# Altium project Angler_Main_PCB_V1.PrjPcb
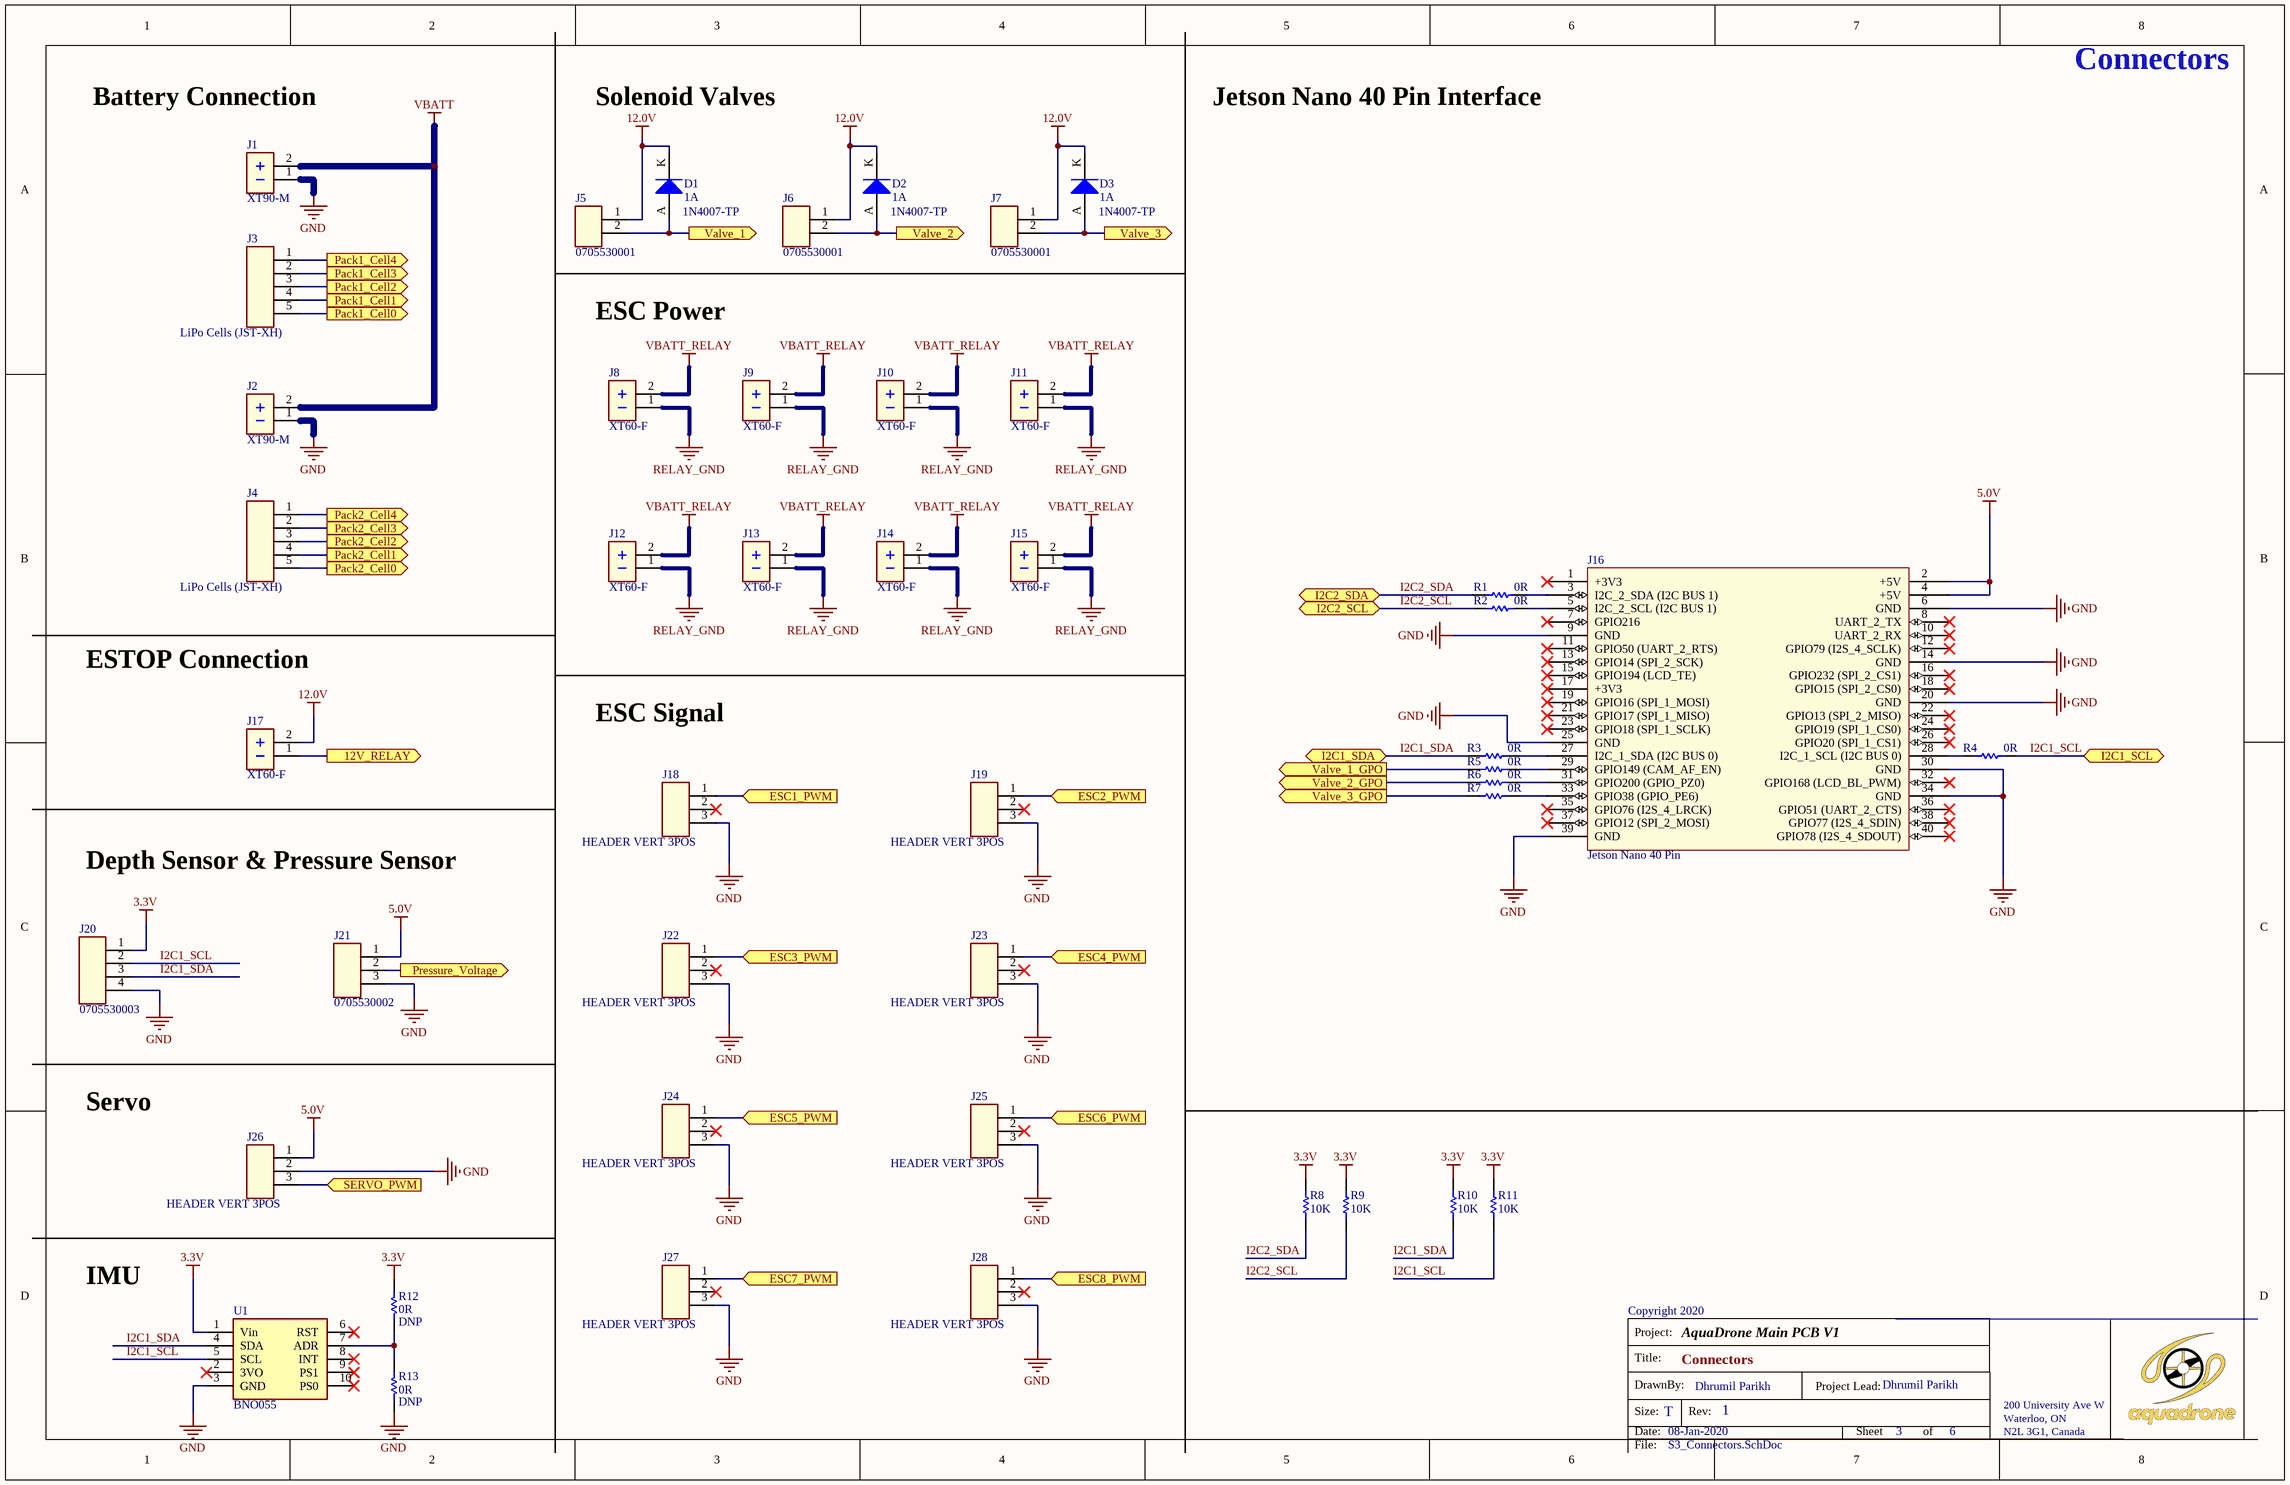
[diagram p0: S3_Connectors.SchDoc]
Copyright: Copyright 2020; DrawnBy: Dhrumil Parikh; PageSize: T; PCBDate: 08-Jan-2020; PCBName: AquaDrone Main PCB V1; PCBPartNumber: AD-PCB-001; PCBRevision: 1.0; ProjectTitle: AquaDrone Main PCB V1; SchDate: 08-Jan-2020; SchDrawnBy: Dhrumil Parikh; SchNumber: AD-SCH-001; SchRevision: 1; SheetTotal: 5
4 sheets, 145 parts. Net scope: flat (ports and power ports of the same name join across sheets).
Board file: AquaDrone_Main_PCB_V1.PcbDoc
Sheets:
  S3_Connectors.SchDoc
  S4_Power_Supply.SchDoc
  S5_Communications.SchDoc
  S6_Solenoid_Valve_Interlock.SchDoc

## Sheet S3_Connectors.SchDoc: Connectors
size Tabloid; DrawnBy: Dhrumil Parikh; SheetNumber: 3; SheetTotal: 6; PageSetup: Record=PageOptions|CenterHorizontal=True|CenterVertical=True|PrintScale=0.62|XCorrection=1.00|YCorrection=1.00|PrintKind=1|BorderSize=5000000|LeftOffset=0|BottomOffset=0|Orientation=2|PaperLength=1000|PaperWidth=1000|Scale=100|PaperSource=7|PrintQuality=600|MediaType=1|DitherType=10|PaperKind=Letter|PrintScaleMode=1; PageSize: T

### Parts
D1  value 1N4007-TP  CURRENT: 1A  [DIOAD1405W90L465D235]  (hidden comment: DIODE GEN PURP 1KV 1A DO41)
D2  value 1N4007-TP  CURRENT: 1A  [DIOAD1405W90L465D235]  (hidden comment: DIODE GEN PURP 1KV 1A DO41)
D3  value 1N4007-TP  CURRENT: 1A  [DIOAD1405W90L465D235]  (hidden comment: DIODE GEN PURP 1KV 1A DO41)
J1  value XT90-M  [XT90]  (hidden comment: CONN XT90 MALE)
J2  value XT90-M  [XT90]  (hidden comment: CONN XT90 MALE)
J3  value LiPo Cells (JST-XH)  [SHDR5W64P0X250_1X5_1490X1150X610P]  (hidden comment: CONN HEADER R/A 5POS 2.5MM)
J4  value LiPo Cells (JST-XH)  [SHDR5W64P0X250_1X5_1490X1150X610P]  (hidden comment: CONN HEADER R/A 5POS 2.5MM)
J5  value 0705530001  [SHDRRA2W109P0_254_1X2_762X1359X699P]  (hidden comment: CONN HEADER R/A 2POS 2.54MM)
J6  value 0705530001  [SHDRRA2W109P0_254_1X2_762X1359X699P]  (hidden comment: CONN HEADER R/A 2POS 2.54MM)
J7  value 0705530001  [SHDRRA2W109P0_254_1X2_762X1359X699P]  (hidden comment: CONN HEADER R/A 2POS 2.54MM)
J8  value XT60-F  [XT60]  (hidden comment: CONN XT60 FEMALE)
J9  value XT60-F  [XT60]  (hidden comment: CONN XT60 FEMALE)
J10  value XT60-F  [XT60]  (hidden comment: CONN XT60 FEMALE)
J11  value XT60-F  [XT60]  (hidden comment: CONN XT60 FEMALE)
J12  value XT60-F  [XT60]  (hidden comment: CONN XT60 FEMALE)
J13  value XT60-F  [XT60]  (hidden comment: CONN XT60 FEMALE)
J14  value XT60-F  [XT60]  (hidden comment: CONN XT60 FEMALE)
J15  value XT60-F  [XT60]  (hidden comment: CONN XT60 FEMALE)
J16  value Jetson Nano 40 Pin  [Jetson Nano]  (hidden comment: Jetson Nano 40 Pin Interface)
J17  value XT60-F  [XT60]  (hidden comment: CONN XT60 FEMALE)
J18  value HEADER VERT 3POS  [61300311121]  (hidden comment: CONN HEADER VERT 3POS 2.54MM)
J19  value HEADER VERT 3POS  [61300311121]  (hidden comment: CONN HEADER VERT 3POS 2.54MM)
J20  value 0705530003  [SHDR4W97P0X254_1X4_1271X1359X699P]  (hidden comment: CONN HEADER R/A 4POS 2.54MM)
J21  value 0705530002  [SHDR3W89P0X254_1X3_1017X1359X699P]  (hidden comment: CONN HEADER R/A 3POS 2.54MM)
J22  value HEADER VERT 3POS  [61300311121]  (hidden comment: CONN HEADER VERT 3POS 2.54MM)
J23  value HEADER VERT 3POS  [61300311121]  (hidden comment: CONN HEADER VERT 3POS 2.54MM)
J24  value HEADER VERT 3POS  [61300311121]  (hidden comment: CONN HEADER VERT 3POS 2.54MM)
J25  value HEADER VERT 3POS  [61300311121]  (hidden comment: CONN HEADER VERT 3POS 2.54MM)
J26  value HEADER VERT 3POS  [61300311121]  (hidden comment: CONN HEADER VERT 3POS 2.54MM)
J27  value HEADER VERT 3POS  [61300311121]  (hidden comment: CONN HEADER VERT 3POS 2.54MM)
J28  value HEADER VERT 3POS  [61300311121]  (hidden comment: CONN HEADER VERT 3POS 2.54MM)
R1  value 0R  [RESC2012X07N]  (hidden comment: RES SMD 0 OHM JUMPER 1/8W 0805)
R2  value 0R  [RESC2012X07N]  (hidden comment: RES SMD 0 OHM JUMPER 1/8W 0805)
R3  value 0R  [RESC2012X07N]  (hidden comment: RES SMD 0 OHM JUMPER 1/8W 0805)
R4  value 0R  [RESC2012X07N]  (hidden comment: RES SMD 0 OHM JUMPER 1/8W 0805)
R5  value 0R  [RESC2012X07N]  (hidden comment: RES SMD 0 OHM JUMPER 1/8W 0805)
R6  value 0R  [RESC2012X07N]  (hidden comment: RES SMD 0 OHM JUMPER 1/8W 0805)
R7  value 0R  [RESC2012X07N]  (hidden comment: RES SMD 0 OHM JUMPER 1/8W 0805)
R8  value 10K  [RESC1608X06N]  (hidden comment: RES SMD 10K OHM 1% 1/10W 0603)
R9  value 10K  [RESC1608X06N]  (hidden comment: RES SMD 10K OHM 1% 1/10W 0603)
R10  value 10K  [RESC1608X06N]  (hidden comment: RES SMD 10K OHM 1% 1/10W 0603)
R11  value 10K  [RESC1608X06N]  (hidden comment: RES SMD 10K OHM 1% 1/10W 0603)
R12  value 0R  NOSTUFF: DNP  [RESC2012X07N]  (hidden comment: RES SMD 0 OHM JUMPER 1/8W 0805)
R13  value 0R  NOSTUFF: DNP  [RESC2012X07N]  (hidden comment: RES SMD 0 OHM JUMPER 1/8W 0805)
U1  IC BNO055  [BNO055]  (value not drawn)

### Ports
12V_RELAY (out), ESC1_PWM (in), ESC2_PWM (in), ESC3_PWM (in), ESC4_PWM (in), ESC5_PWM (in), ESC6_PWM (in), ESC7_PWM (in), ESC8_PWM (in), I2C1_SCL (bidir), I2C1_SDA (bidir), I2C2_SCL (bidir), I2C2_SDA (bidir), Pack1_Cell0 (out), Pack1_Cell1 (out), Pack1_Cell2 (out), Pack1_Cell3 (out), Pack1_Cell4 (out), Pack2_Cell0 (out), Pack2_Cell1 (out), Pack2_Cell2 (out), Pack2_Cell3 (out), Pack2_Cell4 (out), Pressure_Voltage (out), SERVO_PWM (in), Valve_1 (out), Valve_1_GPO (out), Valve_2 (out), Valve_2_GPO (out), Valve_3 (out), Valve_3_GPO (out)

### Nets
3.3V: J20.1 R8.2 R9.2 R10.2 R11.2 R12.1 U1.1(Vin)
5.0V: J16.2(+5V) J16.4(+5V) J21.1 J26.1
12.0V: D1.K D2.K D3.K J5.1 J6.1 J7.1 J17.2
GND: J1.1 J2.1 J16.6(GND) J16.9(GND) J16.14(GND) J16.20(GND) J16.25(GND) J16.30(GND) J16.34(GND) J16.39(GND) J18.3 J19.3 J20.4 J21.3 J22.3 J23.3 J24.3 J25.3 J26.2 J27.3 J28.3 R13.2 U1.3(GND)
RELAY_GND: J8.1 J9.1 J10.1 J11.1 J12.1 J13.1 J14.1 J15.1
VBATT: J1.2 J2.2
VBATT_RELAY: J8.2 J9.2 J10.2 J11.2 J12.2 J13.2 J14.2 J15.2
12V_RELAY: J17.1 ; port 12V_RELAY
ESC1_PWM: J18.1 ; port ESC1_PWM
ESC2_PWM: J19.1 ; port ESC2_PWM
ESC3_PWM: J22.1 ; port ESC3_PWM
ESC4_PWM: J23.1 ; port ESC4_PWM
ESC5_PWM: J24.1 ; port ESC5_PWM
ESC6_PWM: J25.1 ; port ESC6_PWM
ESC7_PWM: J27.1 ; port ESC7_PWM
ESC8_PWM: J28.1 ; port ESC8_PWM
I2C1_SCL: J20.2 R4.2 R11.1 U1.5(SCL) ; port I2C1_SCL
I2C1_SDA: J20.3 R3.1 R10.1 U1.4(SDA) ; port I2C1_SDA
I2C2_SCL: R2.1 R9.1 ; port I2C2_SCL
I2C2_SDA: R1.1 R8.1 ; port I2C2_SDA
Pack1_Cell0: J3.5 ; port Pack1_Cell0
Pack1_Cell1: J3.4 ; port Pack1_Cell1
Pack1_Cell2: J3.3 ; port Pack1_Cell2
Pack1_Cell3: J3.2 ; port Pack1_Cell3
Pack1_Cell4: J3.1 ; port Pack1_Cell4
Pack2_Cell0: J4.5 ; port Pack2_Cell0
Pack2_Cell1: J4.4 ; port Pack2_Cell1
Pack2_Cell2: J4.3 ; port Pack2_Cell2
Pack2_Cell3: J4.2 ; port Pack2_Cell3
Pack2_Cell4: J4.1 ; port Pack2_Cell4
Pressure_Voltage: J21.2 ; port Pressure_Voltage
SERVO_PWM: J26.3 ; port SERVO_PWM
Valve_1: D1.A J5.2 ; port Valve_1
Valve_1_GPO: R5.1 ; port Valve_1_GPO
Valve_2: D2.A J6.2 ; port Valve_2
Valve_2_GPO: R6.1 ; port Valve_2_GPO
Valve_3: D3.A J7.2 ; port Valve_3
Valve_3_GPO: R7.1 ; port Valve_3_GPO
NetJ16_3: J16.3(I2C_2_SDA_(I2C_BUS_1)) R1.2
NetJ16_5: J16.5(I2C_2_SCL_(I2C_BUS_1)) R2.2
NetJ16_27: J16.27(I2C_1_SDA_(I2C_BUS_0)) R3.2
NetJ16_28: J16.28(I2C_1_SCL_(I2C_BUS_0)) R4.1
NetJ16_29: J16.29(GPIO149_(CAM_AF_EN)) R5.2
NetJ16_31: J16.31(GPIO200_(GPIO_PZ0)) R6.2
NetJ16_33: J16.33(GPIO38_(GPIO_PE6)) R7.2
NetR12_2: R12.2 R13.1 U1.7(ADR)

Not connected (* = marked no-connect by the designer): J16 1(+3V3)* 7(GPIO216)* 8(UART_2_TX)* 10(UART_2_RX)* 11(GPIO50_(UART_2_RTS))* 12(GPIO79_(I2S_4_SCLK))* 13(GPIO14_(SPI_2_SCK))* 15(GPIO194_(LCD_TE))* 16(GPIO232_(SPI_2_CS1))* 17(+3V3)* 18(GPIO15_(SPI_2_CS0))* 19(GPIO16_(SPI_1_MOSI))* 21(GPIO17_(SPI_1_MISO))* 22(GPIO13_(SPI_2_MISO))* 23(GPIO18_(SPI_1_SCLK))* 24(GPIO19_(SPI_1_CS0))* 26(GPIO20_(SPI_1_CS1))* 32(GPIO168_(LCD_BL_PWM))* 35(GPIO76_(I2S_4_LRCK))* 36(GPIO51_(UART_2_CTS))* 37(GPIO12_(SPI_2_MOSI))* 38(GPIO77_(I2S_4_SDIN))* 40(GPIO78_(I2S_4_SDOUT))*; J18 2*; J19 2*; J22 2*; J23 2*; J24 2*; J25 2*; J27 2*; J28 2*; U1 2(3VO)* 6(RST)* 8(INT)* 9(PS1)* 10(PS0)*

### Notes on the sheet
- Battery Connection
- Solenoid Valves
- Jetson Nano 40 Pin Interface
- ESC Power
- ESTOP Connection
- ESC Signal
- Depth Sensor & Pressure Sensor
- Servo
- IMU
- Title:
- Project:
- Size:
- Date:
- DrawnBy:
- Rev:
- Project Lead:
- Sheet
- Dhrumil Parikh
- of
- 200 University Ave W
- Waterloo, ON
- N2L 3G1, Canada
- File:

### Library data of the parts
D1-D3 = DIODE GEN PURP 1KV 1A DO41: MFG: Micro Commercial Co; VR: 1000V; COST: 0.14; MFG_PART_NO: 1N4007-TP
J1 J2 = CONN XT90 MALE: MFG_PART_NO: FIT0588; MFG: DFRobot; COST: 5.66000
J3 J4 = CONN HEADER R/A 5POS 2.5MM: MFG_PART_NO: S5B-XH-A(LF)(SN); MFG: JST Sales America Inc.; COST: 0.43
J5-J7 = CONN HEADER R/A 2POS 2.54MM: MFG: Molex; COST: 1.12; MFG_PART_NO: 0705530001
J8-J15 J17 = CONN XT60 FEMALE: MFG_PART_NO: FIT0587; MFG: DFRobot; COST: 2.18
J18 J19 J22-J28 = CONN HEADER VERT 3POS 2.54MM: MFG: Wurth Electronics Inc.; COST: 0.18; MFG_PART_NO: 61300311121
J20 = CONN HEADER R/A 4POS 2.54MM: MFG: Molex; COST: 1.51; MFG_PART_NO: 0705530003
J21 = CONN HEADER R/A 3POS 2.54MM: MFG: Molex; COST: 1.47; MFG_PART_NO: 0705530002
R1-R7 R12 R13 = RES SMD 0 OHM JUMPER 1/8W 0805: MFG_PART_NO: ERJ-6GEY0R00V; MFG: Panasonic; COST: 0.15
R8-R11 = RES SMD 10K OHM 1% 1/10W 0603: MFG_PART_NO: CRCW060310K0FKEA; MFG: Vishay Dale; COST: 0.15; TOLERANCE: 1%
U1 = IC BNO055: MFG: Adafruit Industries LLC; COST: 50; VALUE: BNO055; MFG_PART_NO: BNO055
J16 = Jetson Nano 40 Pin Interface: COST: 60; MFG: Jetson; MFG_PART_NO: Nano

## Sheet S4_Power_Supply.SchDoc: Power Supply
size Tabloid; DrawnBy: Dhrumil Parikh; SheetNumber: 4; SheetTotal: 6; PageSetup: Record=PageOptions|CenterHorizontal=True|CenterVertical=True|PrintScale=0.62|XCorrection=1.00|YCorrection=1.00|PrintKind=1|BorderSize=5000000|LeftOffset=0|BottomOffset=0|Orientation=2|PaperLength=1000|PaperWidth=1000|Scale=100|PaperSource=7|PrintQuality=600|MediaType=1|DitherType=10|PaperKind=Letter|PrintScaleMode=1; PageSize: T
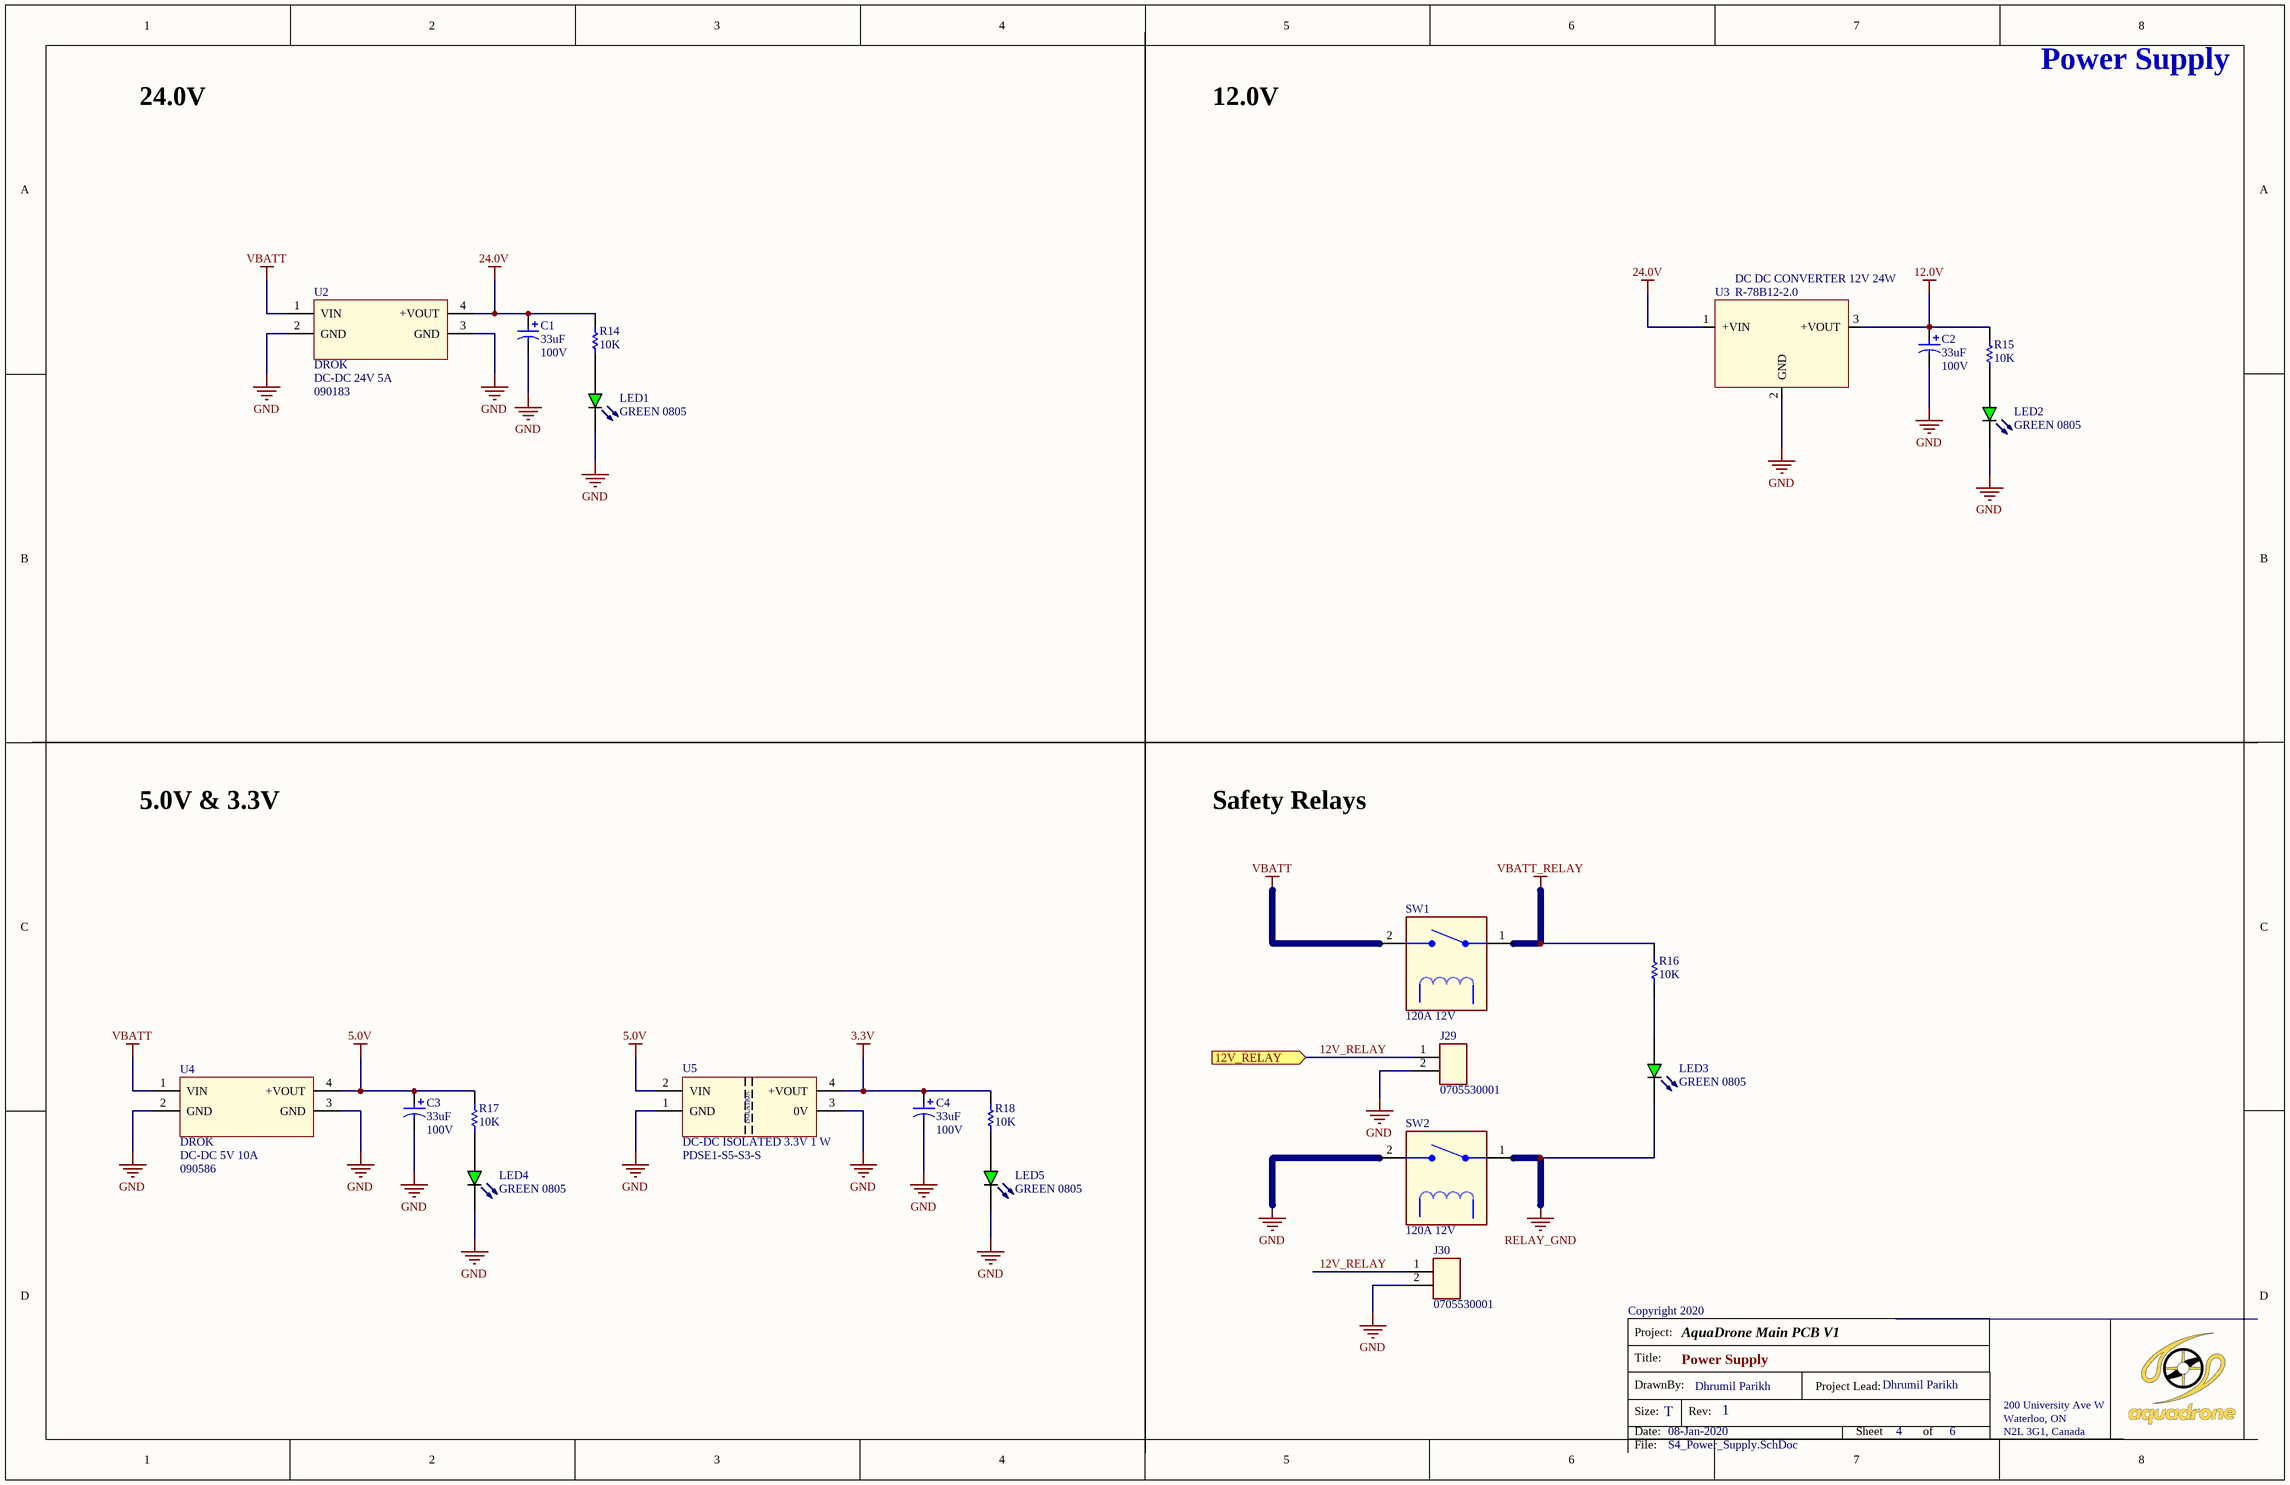
[diagram p1: S4_Power_Supply.SchDoc]

### Parts
C1  value 33uF  VOLTAGE: 100V  [CAPPRD350W60D825H1700]  (hidden comment: CAP ALUM 33UF 20% 100V RADIAL)
C2  value 33uF  VOLTAGE: 100V  [CAPPRD350W60D825H1700]  (hidden comment: CAP ALUM 33UF 20% 100V RADIAL)
C3  value 33uF  VOLTAGE: 100V  [CAPPRD350W60D825H1700]  (hidden comment: CAP ALUM 33UF 20% 100V RADIAL)
C4  value 33uF  VOLTAGE: 100V  [CAPPRD350W60D825H1700]  (hidden comment: CAP ALUM 33UF 20% 100V RADIAL)
J29  value 0705530001  [SHDRRA2W109P0_254_1X2_762X1359X699P]  (hidden comment: CONN HEADER R/A 2POS 2.54MM)
J30  value 0705530001  [SHDRRA2W109P0_254_1X2_762X1359X699P]  (hidden comment: CONN HEADER R/A 2POS 2.54MM)
LED1  value GREEN 0805  [LED0805]  (hidden comment: LED GREEN CLEAR 0805 SMD)
LED2  value GREEN 0805  [LED0805]  (hidden comment: LED GREEN CLEAR 0805 SMD)
LED3  value GREEN 0805  [LED0805]  (hidden comment: LED GREEN CLEAR 0805 SMD)
LED4  value GREEN 0805  [LED0805]  (hidden comment: LED GREEN CLEAR 0805 SMD)
LED5  value GREEN 0805  [LED0805]  (hidden comment: LED GREEN CLEAR 0805 SMD)
R14  value 10K  [RESC1608X06N]  (hidden comment: RES SMD 10K OHM 1% 1/10W 0603)
R15  value 10K  [RESC1608X06N]  (hidden comment: RES SMD 10K OHM 1% 1/10W 0603)
R16  value 10K  [RESC1608X06N]  (hidden comment: RES SMD 10K OHM 1% 1/10W 0603)
R17  value 10K  [RESC1608X06N]  (hidden comment: RES SMD 10K OHM 1% 1/10W 0603)
R18  value 10K  [RESC1608X06N]  (hidden comment: RES SMD 10K OHM 1% 1/10W 0603)
SW1  value 120A 12V  [G9TB-U1ATW-E DC12]  (hidden comment: RELAY GEN PURPOSE SPST 120A 12V)
SW2  value 120A 12V  [G9TB-U1ATW-E DC12]  (hidden comment: RELAY GEN PURPOSE SPST 120A 12V)
U2  MFG: DROK  MFG_PART_NO: 090183  [DROK 090183 24V 5A]  (hidden comment: DC-DC 24V 5A)
U3  DC DC CONVERTER 12V 24W  [R-78B12-2.0]
U4  MFG: DROK  MFG_PART_NO: 090586  [DROK 090586 5V 10A]  (hidden comment: DC-DC 5V 10A)
U5  MFG_PART_NO: PDSE1-S5-S3-S  [PDSE1S5S3S]  (hidden comment: DC-DC ISOLATED 3.3V 1 W)

### Ports
12V_RELAY (in)

### Nets
3.3V: C4.1 R18.2 U5.4(+VOUT)
5.0V: C3.1 R17.2 U4.4(+VOUT) U5.2(VIN)
12.0V: C2.1 R15.2 U3.3(+VOUT)
24.0V: C1.1 R14.2 U2.4(+VOUT) U3.1(+VIN)
GND: C1.2 C2.2 C3.2 C4.2 J29.2 J30.2 LED1.K LED2.K LED4.K LED5.K SW2.2 U2.2(GND) U2.3(GND) U3.2(GND) U4.2(GND) U4.3(GND) U5.1(GND) U5.3(0V)
RELAY_GND: LED3.K SW2.1
VBATT: SW1.2 U2.1(VIN) U4.1(VIN)
VBATT_RELAY: R16.2 SW1.1
12V_RELAY: J29.1 J30.1 ; port 12V_RELAY
NetLED1_A: LED1.A R14.1
NetLED2_A: LED2.A R15.1
NetLED3_A: LED3.A R16.1
NetLED4_A: LED4.A R17.1
NetLED5_A: LED5.A R18.1

### Notes on the sheet
- 24.0V
- 12.0V
- 5.0V & 3.3V
- Safety Relays
- Title:
- Project:
- Size:
- Date:
- DrawnBy:
- Rev:
- Project Lead:
- Sheet
- Dhrumil Parikh
- of
- 200 University Ave W
- Waterloo, ON
- N2L 3G1, Canada
- File:
- (in symbol DC-DC ISOLATED 3.3V 1 W) ISOLATION

### Library data of the parts
C1-C4 = CAP ALUM 33UF 20% 100V RADIAL: MFG_PART_NO: UPM2A330MPD1TD; MFG: Nichicon; COST: 0.18; TOLERANCE: 20%; DIELECTRIC: ALUM
J29 J30 = CONN HEADER R/A 2POS 2.54MM: MFG: Molex; COST: 1.12; MFG_PART_NO: 0705530001
LED1-LED5 = LED GREEN CLEAR 0805 SMD: MFG_PART_NO: 150080VS75000; MFG: Würth Elektronik; COST: 0.26
R14-R18 = RES SMD 10K OHM 1% 1/10W 0603: as R8 on sheet S3_Connectors; COST: 0.15; TOLERANCE: 1%
SW1 SW2 = RELAY GEN PURPOSE SPST 120A 12V: MFG: Omron; COST: 23.27; MFG_PART_NO: G9TB-U1ATW-E DC12
U3 = DC DC CONVERTER 12V 24W: MFG: Recom Power; COST: 14.18; VALUE: DC DC CONVERTER 12V 24W; MFG_PART_NO: R-78B12-2.0
U5 = DC-DC ISOLATED 3.3V 1 W: MFG: CUI Inc.; COST: 3.07; VALUE: DC-DC ISOLATED 3.3V 1 W
U2 = DC-DC 24V 5A: COST: 30; VALUE: DC-DC 24V 5A
U4 = DC-DC 5V 10A: COST: 15; VALUE: DC-DC 5V 10A

## Sheet S5_Communications.SchDoc: Communications
size Tabloid; DrawnBy: Dhrumil Parikh; SheetNumber: 5; SheetTotal: 6; PageSetup: Record=PageOptions|CenterHorizontal=True|CenterVertical=True|PrintScale=0.62|XCorrection=1.00|YCorrection=1.00|PrintKind=1|BorderSize=5000000|LeftOffset=0|BottomOffset=0|Orientation=2|PaperLength=1000|PaperWidth=1000|Scale=100|PaperSource=7|PrintQuality=600|MediaType=1|DitherType=10|PaperKind=Letter|PrintScaleMode=1; PageSize: T
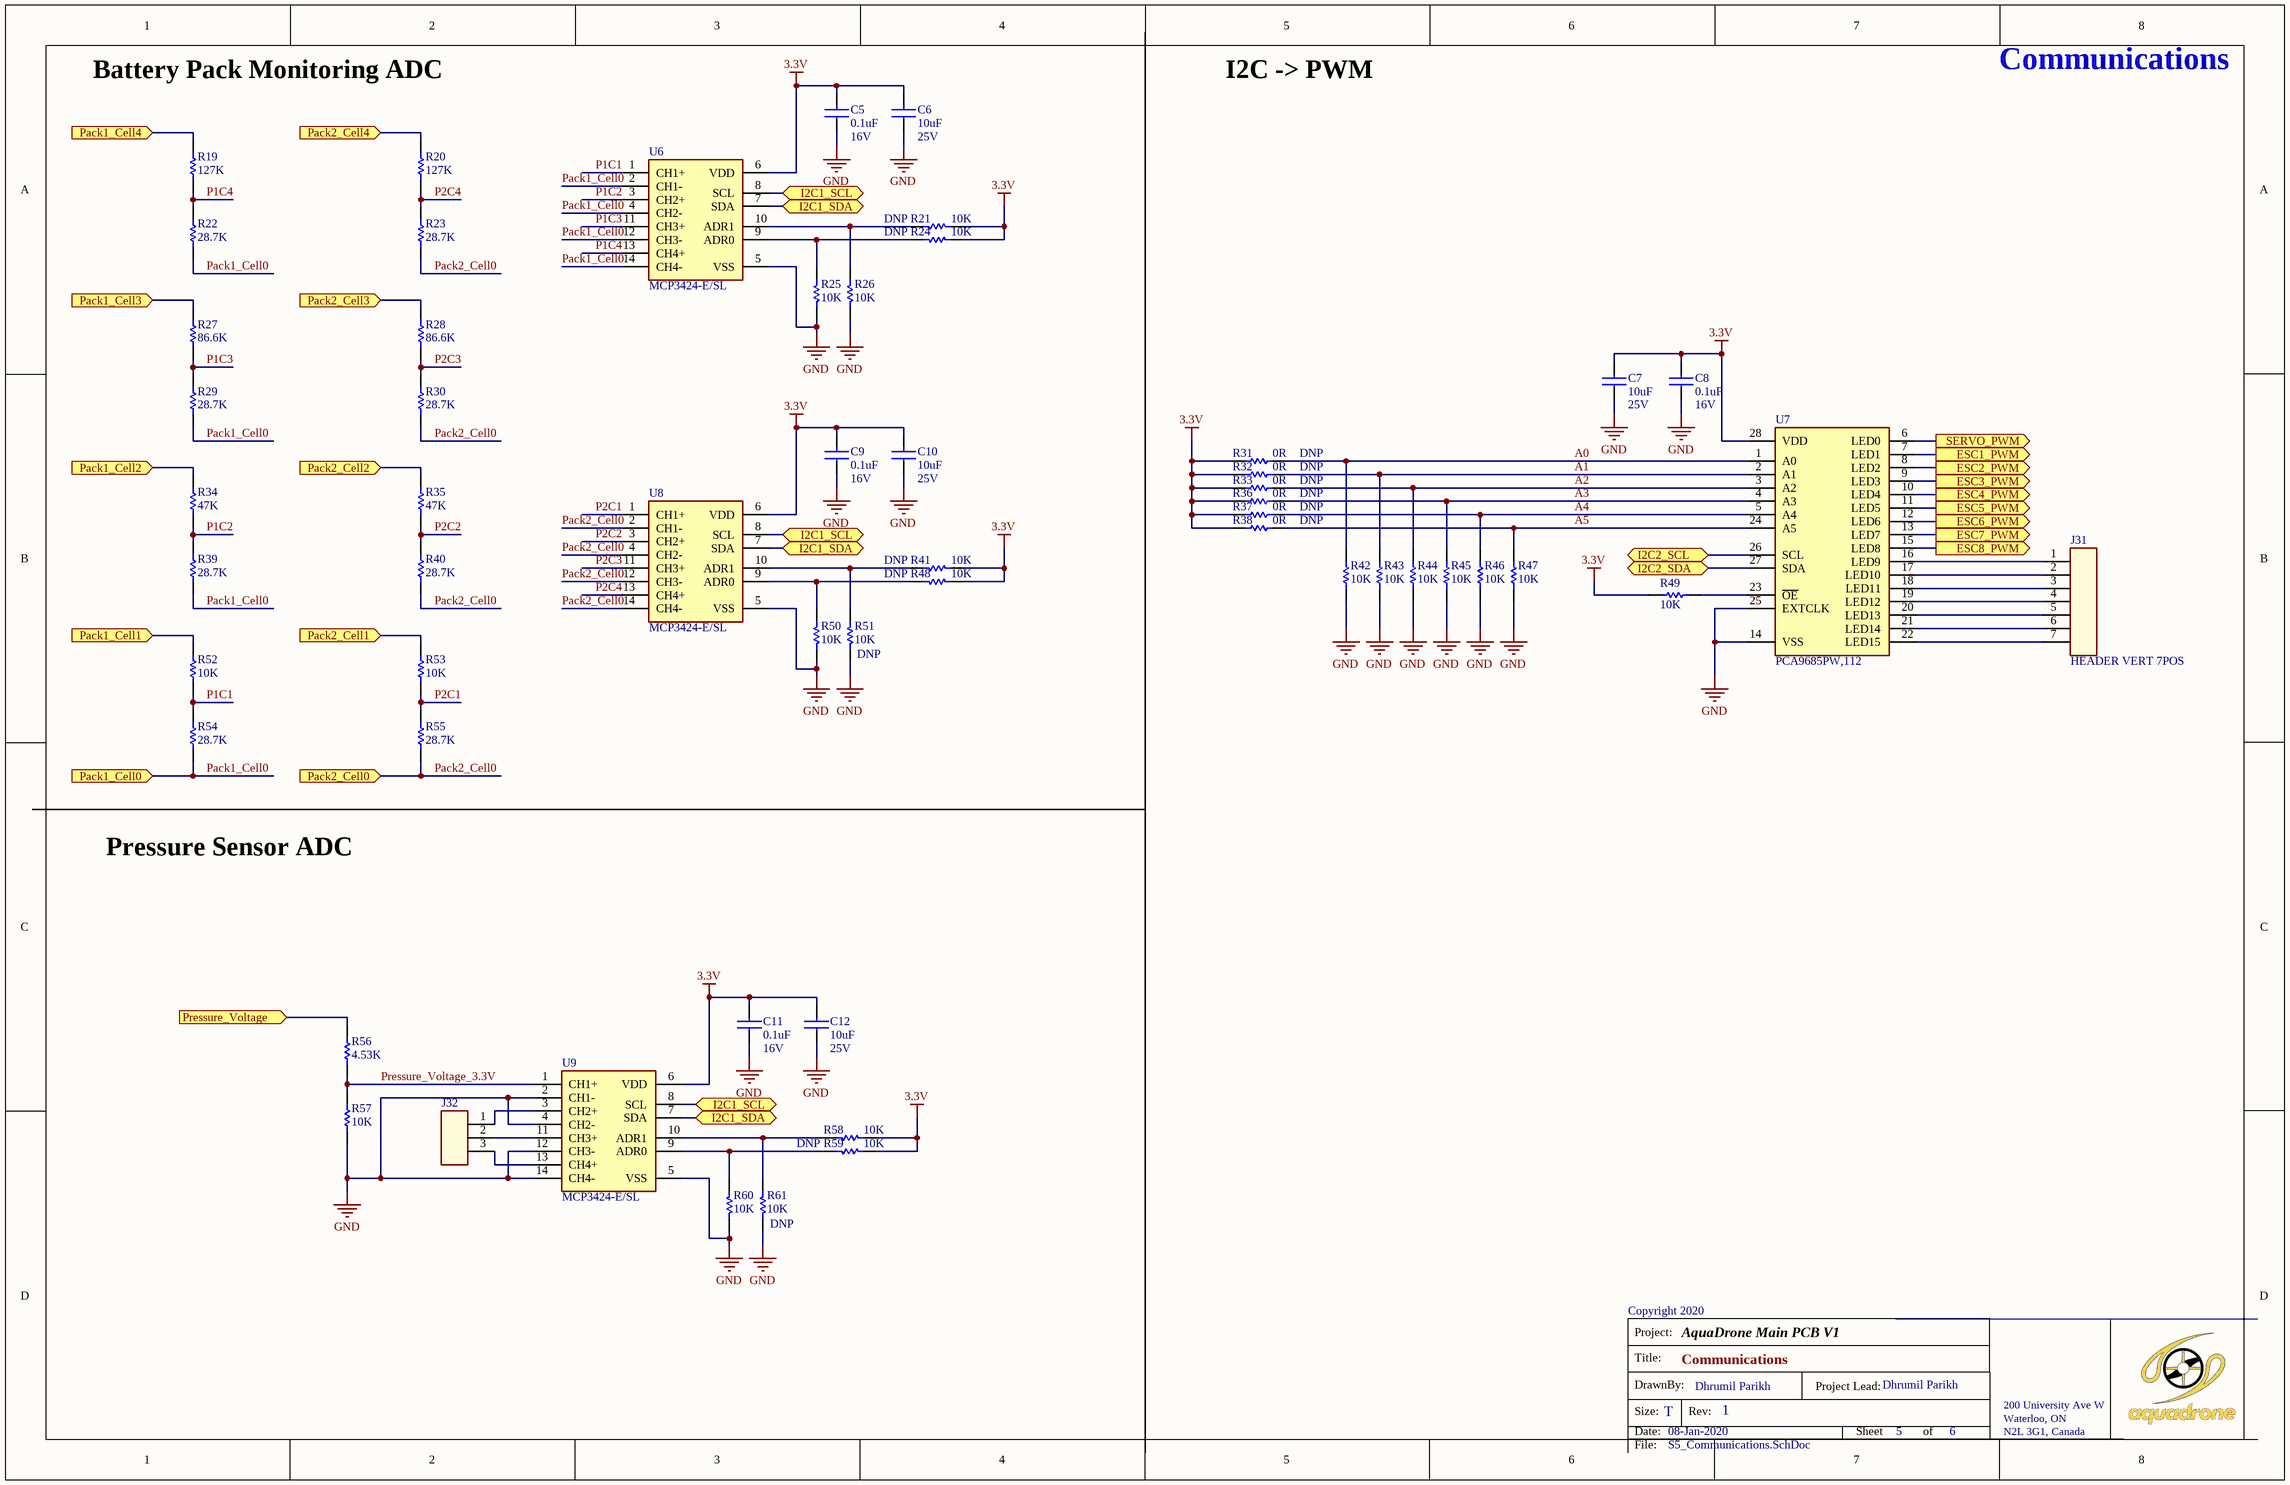
[diagram p2: S5_Communications.SchDoc]

### Parts
C5  value 0.1uF  VOLTAGE: 16V  [CAPC1608X09N]  (hidden comment: CAP CER 0.1UF 16V X7R 0603)
C6  value 10uF  VOLTAGE: 25V  [CAPC1608X09N]  (hidden comment: CAP CER 10UF 25V X5R 0603)
C7  value 10uF  VOLTAGE: 25V  [CAPC1608X09N]  (hidden comment: CAP CER 10UF 25V X5R 0603)
C8  value 0.1uF  VOLTAGE: 16V  [CAPC1608X09N]  (hidden comment: CAP CER 0.1UF 16V X7R 0603)
C9  value 0.1uF  VOLTAGE: 16V  [CAPC1608X09N]  (hidden comment: CAP CER 0.1UF 16V X7R 0603)
C10  value 10uF  VOLTAGE: 25V  [CAPC1608X09N]  (hidden comment: CAP CER 10UF 25V X5R 0603)
C11  value 0.1uF  VOLTAGE: 16V  [CAPC1608X09N]  (hidden comment: CAP CER 0.1UF 16V X7R 0603)
C12  value 10uF  VOLTAGE: 25V  [CAPC1608X09N]  (hidden comment: CAP CER 10UF 25V X5R 0603)
J31  value HEADER VERT 7POS  [61300711121]  (hidden comment: CONN HEADER VERT 7POS 2.54MM)
J32  CONN HEADER VERT 3POS 2.54MM  [61300311121]  (value not drawn)
R19  value 127K  [RESC1608X06N]  (hidden comment: RES SMD 127K OHM 1% 1/10W 0603)
R20  value 127K  [RESC1608X06N]  (hidden comment: RES SMD 127K OHM 1% 1/10W 0603)
R21  value 10K  NOSTUFF: DNP  [RESC1608X06N]  (hidden comment: RES SMD 10K OHM 1% 1/10W 0603)
R22  value 28.7K  [RESC1608X06N]  (hidden comment: RES SMD 28.7K OHM 1% 1/10W 0603)
R23  value 28.7K  [RESC1608X06N]  (hidden comment: RES SMD 28.7K OHM 1% 1/10W 0603)
R24  value 10K  NOSTUFF: DNP  [RESC1608X06N]  (hidden comment: RES SMD 10K OHM 1% 1/10W 0603)
R25  value 10K  [RESC1608X06N]  (hidden comment: RES SMD 10K OHM 1% 1/10W 0603)
R26  value 10K  [RESC1608X06N]  (hidden comment: RES SMD 10K OHM 1% 1/10W 0603)
R27  value 86.6K  [RESC1608X06N]  (hidden comment: RES SMD 86.6K OHM 1% 1/10W 0603)
R28  value 86.6K  [RESC1608X06N]  (hidden comment: RES SMD 86.6K OHM 1% 1/10W 0603)
R29  value 28.7K  [RESC1608X06N]  (hidden comment: RES SMD 28.7K OHM 1% 1/10W 0603)
R30  value 28.7K  [RESC1608X06N]  (hidden comment: RES SMD 28.7K OHM 1% 1/10W 0603)
R31  value 0R  NOSTUFF: DNP  [RESC2012X07N]  (hidden comment: RES SMD 0 OHM JUMPER 1/8W 0805)
R32  value 0R  NOSTUFF: DNP  [RESC2012X07N]  (hidden comment: RES SMD 0 OHM JUMPER 1/8W 0805)
R33  value 0R  NOSTUFF: DNP  [RESC2012X07N]  (hidden comment: RES SMD 0 OHM JUMPER 1/8W 0805)
R34  value 47K  [RESC1608X06N]  (hidden comment: RES SMD 47K OHM 1% 1/10W 0603)
R35  value 47K  [RESC1608X06N]  (hidden comment: RES SMD 47K OHM 1% 1/10W 0603)
R36  value 0R  NOSTUFF: DNP  [RESC2012X07N]  (hidden comment: RES SMD 0 OHM JUMPER 1/8W 0805)
R37  value 0R  NOSTUFF: DNP  [RESC2012X07N]  (hidden comment: RES SMD 0 OHM JUMPER 1/8W 0805)
R38  value 0R  NOSTUFF: DNP  [RESC2012X07N]  (hidden comment: RES SMD 0 OHM JUMPER 1/8W 0805)
R39  value 28.7K  [RESC1608X06N]  (hidden comment: RES SMD 28.7K OHM 1% 1/10W 0603)
R40  value 28.7K  [RESC1608X06N]  (hidden comment: RES SMD 28.7K OHM 1% 1/10W 0603)
R41  value 10K  NOSTUFF: DNP  [RESC1608X06N]  (hidden comment: RES SMD 10K OHM 1% 1/10W 0603)
R42  value 10K  [RESC1608X06N]  (hidden comment: RES SMD 10K OHM 1% 1/10W 0603)
R43  value 10K  [RESC1608X06N]  (hidden comment: RES SMD 10K OHM 1% 1/10W 0603)
R44  value 10K  [RESC1608X06N]  (hidden comment: RES SMD 10K OHM 1% 1/10W 0603)
R45  value 10K  [RESC1608X06N]  (hidden comment: RES SMD 10K OHM 1% 1/10W 0603)
R46  value 10K  [RESC1608X06N]  (hidden comment: RES SMD 10K OHM 1% 1/10W 0603)
R47  value 10K  [RESC1608X06N]  (hidden comment: RES SMD 10K OHM 1% 1/10W 0603)
R48  value 10K  NOSTUFF: DNP  [RESC1608X06N]  (hidden comment: RES SMD 10K OHM 1% 1/10W 0603)
R49  value 10K  [RESC1608X06N]  (hidden comment: RES SMD 10K OHM 1% 1/10W 0603)
R50  value 10K  [RESC1608X06N]  (hidden comment: RES SMD 10K OHM 1% 1/10W 0603)
R51  value 10K  NOSTUFF: DNP  [RESC1608X06N]  (hidden comment: RES SMD 10K OHM 1% 1/10W 0603)
R52  value 10K  [RESC1608X06N]  (hidden comment: RES SMD 10K OHM 1% 1/10W 0603)
R53  value 10K  [RESC1608X06N]  (hidden comment: RES SMD 10K OHM 1% 1/10W 0603)
R54  value 28.7K  [RESC1608X06N]  (hidden comment: RES SMD 28.7K OHM 1% 1/10W 0603)
R55  value 28.7K  [RESC1608X06N]  (hidden comment: RES SMD 28.7K OHM 1% 1/10W 0603)
R56  value 4.53K  [RESC1608X06N]  (hidden comment: RES SMD 4.53K OHM 1% 1/10W 0603)
R57  value 10K  [RESC1608X06N]  (hidden comment: RES SMD 10K OHM 1% 1/10W 0603)
R58  value 10K  [RESC1608X06N]  (hidden comment: RES SMD 10K OHM 1% 1/10W 0603)
R59  value 10K  NOSTUFF: DNP  [RESC1608X06N]  (hidden comment: RES SMD 10K OHM 1% 1/10W 0603)
R60  value 10K  [RESC1608X06N]  (hidden comment: RES SMD 10K OHM 1% 1/10W 0603)
R61  value 10K  NOSTUFF: DNP  [RESC1608X06N]  (hidden comment: RES SMD 10K OHM 1% 1/10W 0603)
U6  MFG_PART_NO: MCP3424-E/SL  [SOIC127P600X175-14N]  (hidden comment: IC ADC 18BIT SIGMA-DELTA 14SOIC)
U7  MFG_PART_NO: PCA9685PW,112  [SOP65P640X110-28N]  (hidden comment: IC LED DRVR LIN DIM 25MA 28TSSOP)
U8  MFG_PART_NO: MCP3424-E/SL  [SOIC127P600X175-14N]  (hidden comment: IC ADC 18BIT SIGMA-DELTA 14SOIC)
U9  MFG_PART_NO: MCP3424-E/SL  [SOIC127P600X175-14N]  (hidden comment: IC ADC 18BIT SIGMA-DELTA 14SOIC)

### Ports
ESC1_PWM (out), ESC2_PWM (out), ESC3_PWM (out), ESC4_PWM (out), ESC5_PWM (out), ESC6_PWM (out), ESC7_PWM (out), ESC8_PWM (out), I2C1_SCL (bidir), I2C1_SDA (bidir), I2C2_SCL (bidir), I2C2_SDA (bidir), Pack1_Cell0 (in), Pack1_Cell1 (in), Pack1_Cell2 (in), Pack1_Cell3 (in), Pack1_Cell4 (in), Pack2_Cell0 (in), Pack2_Cell1 (in), Pack2_Cell2 (in), Pack2_Cell3 (in), Pack2_Cell4 (in), Pressure_Voltage (in), SERVO_PWM (out)

### Nets
3.3V: C5.2 C6.2 C7.2 C8.2 C9.2 C10.2 C11.2 C12.2 R21.1 R24.1 R31.1 R32.1 R33.1 R36.1 R37.1 R38.1 R41.1 R48.1 R49.1 R58.1 R59.1 U6.6(VDD) U7.28(VDD) U8.6(VDD) U9.6(VDD)
GND: C5.1 C6.1 C7.1 C8.1 C9.1 C10.1 C11.1 C12.1 R25.1 R26.1 R42.1 R43.1 R44.1 R45.1 R46.1 R47.1 R50.1 R51.1 R57.1 R60.1 R61.1 U6.5(VSS) U7.14(VSS) U7.25(EXTCLK) U8.5(VSS) U9.2(CH1-) U9.4(CH2-) U9.5(VSS) U9.12(CH3-) U9.14(CH4-)
A0: R31.2 R42.2 U7.1(A0)  [project net A0_5]
A1: R32.2 R43.2 U7.2(A1)  [project net A1_5]
A2: R33.2 R44.2 U7.3(A2)  [project net A2_5]
A3: R36.2 R45.2 U7.4(A3)  [project net A3_5]
A4: R37.2 R46.2 U7.5(A4)  [project net A4_5]
A5: R38.2 R47.2 U7.24(A5)  [project net A5_5]
ESC1_PWM: U7.7(LED1) ; port ESC1_PWM
ESC2_PWM: U7.8(LED2) ; port ESC2_PWM
ESC3_PWM: U7.9(LED3) ; port ESC3_PWM
ESC4_PWM: U7.10(LED4) ; port ESC4_PWM
ESC5_PWM: U7.11(LED5) ; port ESC5_PWM
ESC6_PWM: U7.12(LED6) ; port ESC6_PWM
ESC7_PWM: U7.13(LED7) ; port ESC7_PWM
ESC8_PWM: U7.15(LED8) ; port ESC8_PWM
I2C1_SCL: U6.8(SCL) U8.8(SCL) U9.8(SCL) ; port I2C1_SCL
I2C1_SDA: U6.7(SDA) U8.7(SDA) U9.7(SDA) ; port I2C1_SDA
I2C2_SCL: U7.26(SCL) ; port I2C2_SCL
I2C2_SDA: U7.27(SDA) ; port I2C2_SDA
P1C1: R52.1 R54.2 U6.1(CH1+)  [project net P1C1_5]
P1C2: R34.1 R39.2 U6.3(CH2+)  [project net P1C2_5]
P1C3: R27.1 R29.2 U6.11(CH3+)  [project net P1C3_5]
P1C4: R19.1 R22.2 U6.13(CH4+)  [project net P1C4_5]
P2C1: R53.1 R55.2 U8.1(CH1+)  [project net P2C1_5]
P2C2: R35.1 R40.2 U8.3(CH2+)  [project net P2C2_5]
P2C3: R28.1 R30.2 U8.11(CH3+)  [project net P2C3_5]
P2C4: R20.1 R23.2 U8.13(CH4+)  [project net P2C4_5]
Pack1_Cell0: R22.1 R29.1 R39.1 R54.1 U6.2(CH1-) U6.4(CH2-) U6.12(CH3-) U6.14(CH4-) ; port Pack1_Cell0
Pack1_Cell1: R52.2 ; port Pack1_Cell1
Pack1_Cell2: R34.2 ; port Pack1_Cell2
Pack1_Cell3: R27.2 ; port Pack1_Cell3
Pack1_Cell4: R19.2 ; port Pack1_Cell4
Pack2_Cell0: R23.1 R30.1 R40.1 R55.1 U8.2(CH1-) U8.4(CH2-) U8.12(CH3-) U8.14(CH4-) ; port Pack2_Cell0
Pack2_Cell1: R53.2 ; port Pack2_Cell1
Pack2_Cell2: R35.2 ; port Pack2_Cell2
Pack2_Cell3: R28.2 ; port Pack2_Cell3
Pack2_Cell4: R20.2 ; port Pack2_Cell4
Pressure_Voltage: R56.2 ; port Pressure_Voltage
Pressure_Voltage_3.3V: R56.1 R57.2 U9.1(CH1+)  [project net Pressure_Voltage_3.3V_5]
SERVO_PWM: U7.6(LED0) ; port SERVO_PWM
NetJ31_1: J31.1 U7.16(LED9)
NetJ31_2: J31.2 U7.17(LED10)
NetJ31_3: J31.3 U7.18(LED11)
NetJ31_4: J31.4 U7.19(LED12)
NetJ31_5: J31.5 U7.20(LED13)
NetJ31_6: J31.6 U7.21(LED14)
NetJ31_7: J31.7 U7.22(LED15)
NetJ32_1: J32.1 U9.3(CH2+)
NetJ32_2: J32.2 U9.11(CH3+)
NetJ32_3: J32.3 U9.13(CH4+)
NetR21_2: R21.2 R26.2 U6.10(ADR1)
NetR24_2: R24.2 R25.2 U6.9(ADR0)
NetR41_2: R41.2 R51.2 U8.10(ADR1)
NetR48_2: R48.2 R50.2 U8.9(ADR0)
NetR49_2: R49.2 U7.23(~{OE})
NetR58_2: R58.2 R61.2 U9.10(ADR1)
NetR59_2: R59.2 R60.2 U9.9(ADR0)

### Notes on the sheet
- Battery Pack Monitoring ADC
- I2C -> PWM
- Pressure Sensor ADC
- Title:
- Project:
- Size:
- Date:
- DrawnBy:
- Rev:
- Project Lead:
- Sheet
- Dhrumil Parikh
- of
- 200 University Ave W
- Waterloo, ON
- N2L 3G1, Canada
- File:

### Library data of the parts
C5 C8 C9 C11 = CAP CER 0.1UF 16V X7R 0603: MFG_PART_NO: C0603C104M4RACTU; MFG: KEMET; TOLERANCE: 20%; COST: 0.14; DIELECTRIC: X7R
C6 C7 C10 C12 = CAP CER 10UF 25V X5R 0603: MFG_PART_NO: C1608X5R1E106M080AC; MFG: KEMET; TOLERANCE: 20%; COST: 0.14; DIELECTRIC: X5R
J31 = CONN HEADER VERT 7POS 2.54MM: MFG: Wurth Electronics Inc.; COST: 0.53; MFG_PART_NO: 61300711121
J32 = CONN HEADER VERT 3POS 2.54MM: MFG: Wurth Electronics Inc.; COST: 0.18; MFG_PART_NO: 61300311121; VALUE: HEADER VERT 3POS
R19 R20 = RES SMD 127K OHM 1% 1/10W 0603: MFG_PART_NO: CRCW0603127KFKEA; MFG: Vishay Dale; COST: 0.15; TOLERANCE: 1%
R21 R24-R26 R41-R53 R57-R61 = RES SMD 10K OHM 1% 1/10W 0603: as R8 on sheet S3_Connectors; COST: 0.15; TOLERANCE: 1%
R22 R23 R29 R30 R39 R40 R54 R55 = RES SMD 28.7K OHM 1% 1/10W 0603: MFG_PART_NO: RC0603FR-0728K7L; MFG: Yageo; COST: 0.15; TOLERANCE: 1%
R27 R28 = RES SMD 86.6K OHM 1% 1/10W 0603: MFG_PART_NO: RC0603FR-0786K6L; MFG: Yageo; COST: 0.15; TOLERANCE: 1%
R31-R33 R36-R38 = RES SMD 0 OHM JUMPER 1/8W 0805: as R1 on sheet S3_Connectors; COST: 0.15
R34 R35 = RES SMD 47K OHM 1% 1/10W 0603: MFG_PART_NO: RC0603FR-0747KL; MFG: Yageo; COST: 0.15; TOLERANCE: 1%
R56 = RES SMD 4.53K OHM 1% 1/10W 0603: MFG_PART_NO: RC0603FR-074K53L; MFG: Yageo; COST: 0.15; TOLERANCE: 1%
U6 U8 U9 = IC ADC 18BIT SIGMA-DELTA 14SOIC: MFG: Microchip Technology; VALUE: MCP3424-E/SL; COST: 5.98
U7 = IC LED DRVR LIN DIM 25MA 28TSSOP: MFG: NXP USA Inc.; VALUE: PCA9685PW,112; COST: 3.46

## Sheet S6_Solenoid_Valve_Interlock.SchDoc: Solenoid Valve Interlock
size Tabloid; DrawnBy: Dhrumil Parikh; SheetNumber: 6; SheetTotal: 6; PageSetup: Record=PageOptions|CenterHorizontal=True|CenterVertical=True|PrintScale=0.62|XCorrection=1.00|YCorrection=1.00|PrintKind=1|BorderSize=5000000|LeftOffset=0|BottomOffset=0|Orientation=2|PaperLength=1000|PaperWidth=1000|Scale=100|PaperSource=7|PrintQuality=600|MediaType=1|DitherType=10|PaperKind=Letter|PrintScaleMode=1; PageSize: T
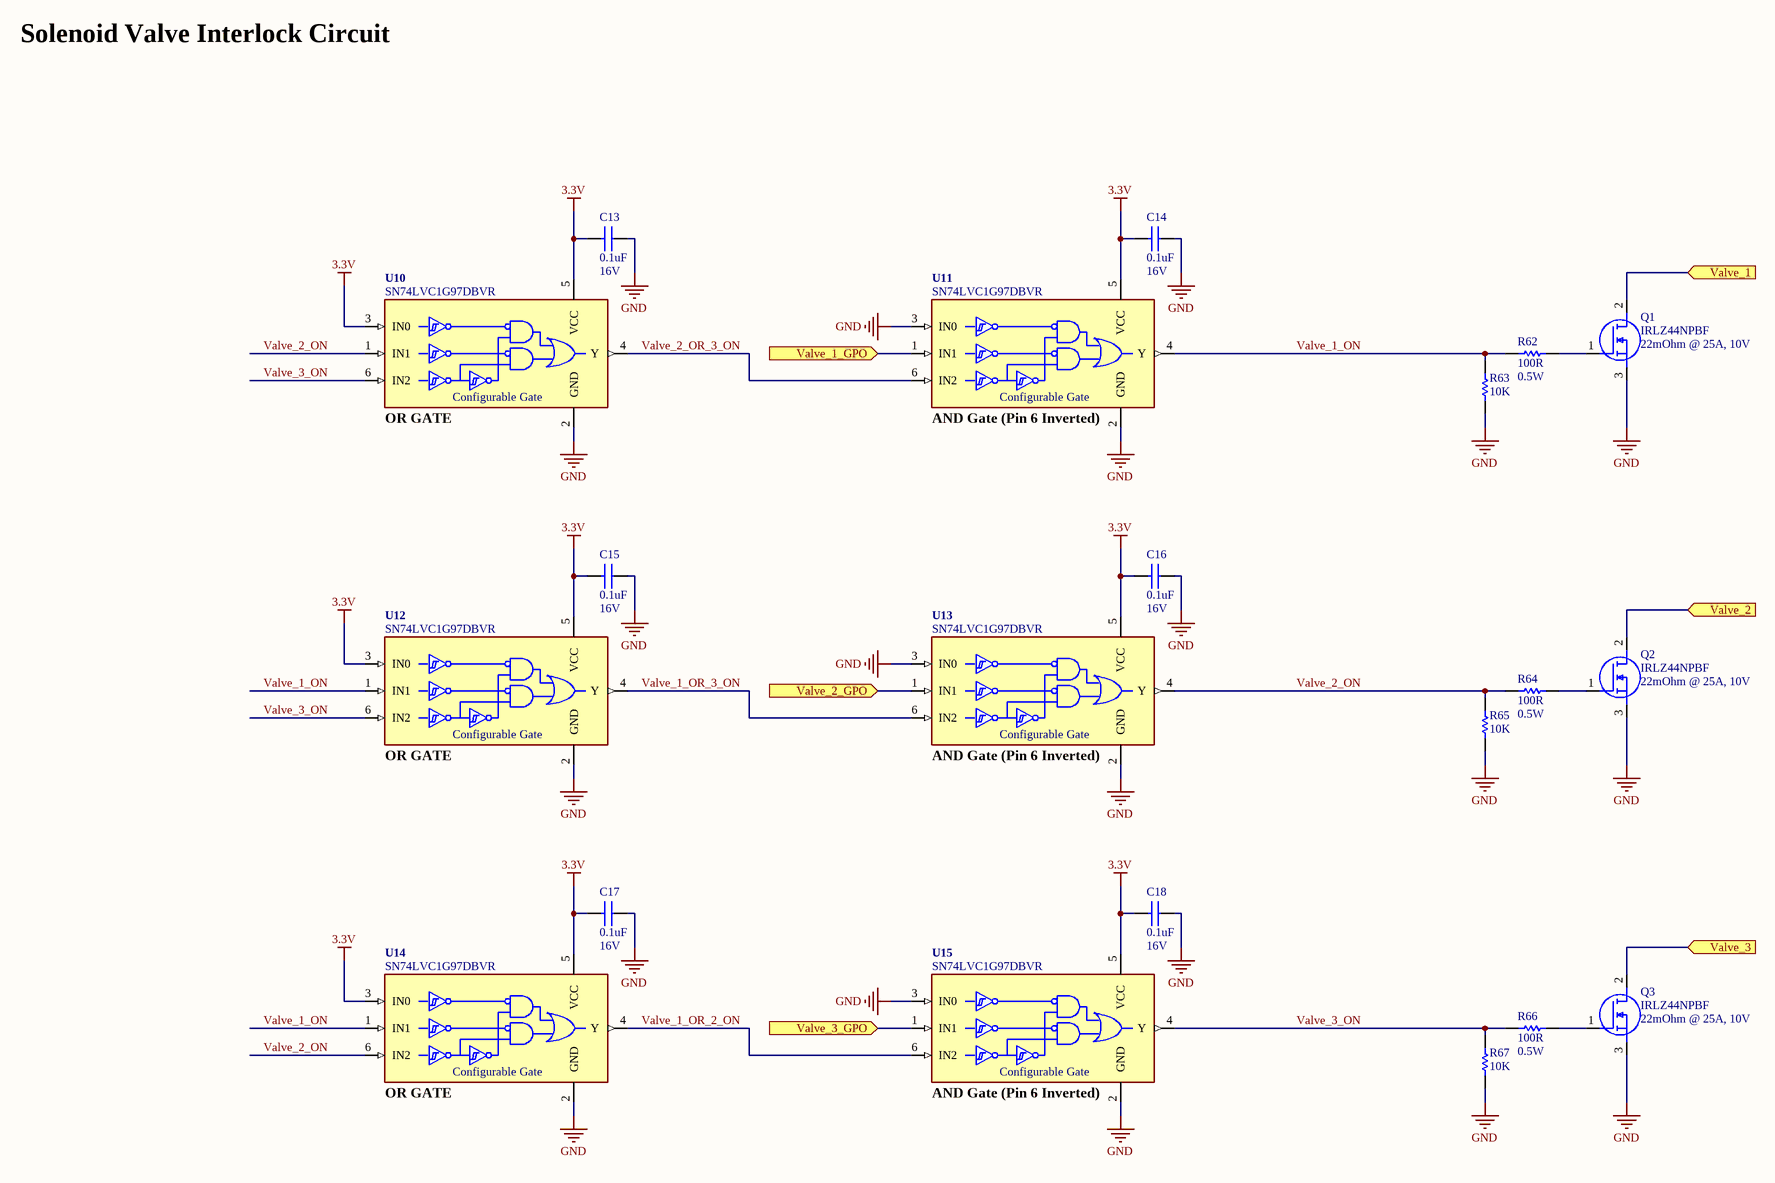
[diagram p3: S6_Solenoid_Valve_Interlock.SchDoc]

### Parts
C13  value 0.1uF  VOLTAGE: 16V  [CAPC1608X09N]  (hidden comment: CAP CER 0.1UF 16V X7R 0603)
C14  value 0.1uF  VOLTAGE: 16V  [CAPC1608X09N]  (hidden comment: CAP CER 0.1UF 16V X7R 0603)
C15  value 0.1uF  VOLTAGE: 16V  [CAPC1608X09N]  (hidden comment: CAP CER 0.1UF 16V X7R 0603)
C16  value 0.1uF  VOLTAGE: 16V  [CAPC1608X09N]  (hidden comment: CAP CER 0.1UF 16V X7R 0603)
C17  value 0.1uF  VOLTAGE: 16V  [CAPC1608X09N]  (hidden comment: CAP CER 0.1UF 16V X7R 0603)
C18  value 0.1uF  VOLTAGE: 16V  [CAPC1608X09N]  (hidden comment: CAP CER 0.1UF 16V X7R 0603)
Q1  value 22mOhm @ 25A, 10V  MFG_PART_NO: IRLZ44NPBF  [TO254P469X1042X1967-3P]  (hidden comment: MOSFET N-CH 55V 47A TO-220AB)
Q2  value 22mOhm @ 25A, 10V  MFG_PART_NO: IRLZ44NPBF  [TO254P469X1042X1967-3P]  (hidden comment: MOSFET N-CH 55V 47A TO-220AB)
Q3  value 22mOhm @ 25A, 10V  MFG_PART_NO: IRLZ44NPBF  [TO254P469X1042X1967-3P]  (hidden comment: MOSFET N-CH 55V 47A TO-220AB)
R62  value 100R  POWER: 0.5W  [RESC3116X06N]  (hidden comment: RES 100 OHM 1% 1/2W 1206)
R63  value 10K  [RESC1608X06N]  (hidden comment: RES SMD 10K OHM 1% 1/10W 0603)
R64  value 100R  POWER: 0.5W  [RESC3116X06N]  (hidden comment: RES 100 OHM 1% 1/2W 1206)
R65  value 10K  [RESC1608X06N]  (hidden comment: RES SMD 10K OHM 1% 1/10W 0603)
R66  value 100R  POWER: 0.5W  [RESC3116X06N]  (hidden comment: RES 100 OHM 1% 1/2W 1206)
R67  value 10K  [RESC1608X06N]  (hidden comment: RES SMD 10K OHM 1% 1/10W 0603)
U10  value SN74LVC1G97DBVR  [SOT65P210X110-6N_SN74LVC1G97DCK]  (hidden comment: IC CONFIG MULT-FUNC GATE SOT23-6)
U11  value SN74LVC1G97DBVR  [SOT65P210X110-6N_SN74LVC1G97DCK]  (hidden comment: IC CONFIG MULT-FUNC GATE SOT23-6)
U12  value SN74LVC1G97DBVR  [SOT65P210X110-6N_SN74LVC1G97DCK]  (hidden comment: IC CONFIG MULT-FUNC GATE SOT23-6)
U13  value SN74LVC1G97DBVR  [SOT65P210X110-6N_SN74LVC1G97DCK]  (hidden comment: IC CONFIG MULT-FUNC GATE SOT23-6)
U14  value SN74LVC1G97DBVR  [SOT65P210X110-6N_SN74LVC1G97DCK]  (hidden comment: IC CONFIG MULT-FUNC GATE SOT23-6)
U15  value SN74LVC1G97DBVR  [SOT65P210X110-6N_SN74LVC1G97DCK]  (hidden comment: IC CONFIG MULT-FUNC GATE SOT23-6)

### Ports
Valve_1 (in), Valve_1_GPO (in), Valve_2 (in), Valve_2_GPO (in), Valve_3 (in), Valve_3_GPO (in)

### Nets
3.3V: C13.2 C14.2 C15.2 C16.2 C17.2 C18.2 U10.3(IN0) U10.5(VCC) U11.5(VCC) U12.3(IN0) U12.5(VCC) U13.5(VCC) U14.3(IN0) U14.5(VCC) U15.5(VCC)
GND: C13.1 C14.1 C15.1 C16.1 C17.1 C18.1 Q1.3(S) Q2.3(S) Q3.3(S) R63.1 R65.1 R67.1 U10.2(GND) U11.2(GND) U11.3(IN0) U12.2(GND) U13.2(GND) U13.3(IN0) U14.2(GND) U15.2(GND) U15.3(IN0)
Valve_1: Q1.2(D) ; port Valve_1
Valve_1_GPO: U11.1(IN1) ; port Valve_1_GPO
Valve_1_ON: R62.1 R63.2 U11.4(Y) U12.1(IN1) U14.1(IN1)  [project net Valve_1_ON_6]
Valve_1_OR_2_ON: U14.4(Y) U15.6(IN2)  [project net Valve_1_OR_2_ON_6]
Valve_1_OR_3_ON: U12.4(Y) U13.6(IN2)  [project net Valve_1_OR_3_ON_6]
Valve_2: Q2.2(D) ; port Valve_2
Valve_2_GPO: U13.1(IN1) ; port Valve_2_GPO
Valve_2_ON: R64.1 R65.2 U10.1(IN1) U13.4(Y) U14.6(IN2)  [project net Valve_2_ON_6]
Valve_2_OR_3_ON: U10.4(Y) U11.6(IN2)  [project net Valve_2_OR_3_ON_6]
Valve_3: Q3.2(D) ; port Valve_3
Valve_3_GPO: U15.1(IN1) ; port Valve_3_GPO
Valve_3_ON: R66.1 R67.2 U10.6(IN2) U12.6(IN2) U15.4(Y)  [project net Valve_3_ON_6]
NetQ1_1: Q1.1(G) R62.2
NetQ2_1: Q2.1(G) R64.2
NetQ3_1: Q3.1(G) R66.2

### Notes on the sheet
- Solenoid Valve Interlock Circuit
- (near U10) OR GATE
- (near U11) AND Gate (Pin 6 Inverted)
- (near U12) OR GATE
- (near U13) AND Gate (Pin 6 Inverted)
- (near U14) OR GATE
- (near U15) AND Gate (Pin 6 Inverted)
- Title:
- Project:
- Size:
- Date:
- DrawnBy:
- Rev:
- Project Lead:
- Sheet
- Dhrumil Parikh
- of
- 200 University Ave W
- Waterloo, ON
- N2L 3G1, Canada
- File:
- (in symbol IC CONFIG MULT-FUNC GATE SOT23-6) Configurable Gate

### Library data of the parts
C13-C18 = CAP CER 0.1UF 16V X7R 0603: as C5 on sheet S5_Communications; COST: 0.14; DIELECTRIC: X7R
Q1-Q3 = MOSFET N-CH 55V 47A TO-220AB: MFG: Infineon Technologies; COST: 1.47
R62 R64 R66 = RES 100 OHM 1% 1/2W 1206: MFG_PART_NO: RNCP1206FTD100R; MFG: Stackpole Electronics Inc; COST: 0.15; TOLERANCE: 1%
R63 R65 R67 = RES SMD 10K OHM 1% 1/10W 0603: as R8 on sheet S3_Connectors; COST: 0.15; TOLERANCE: 1%
U10-U15 = IC CONFIG MULT-FUNC GATE SOT23-6: MFG: TI; COST: 0.58; MFG_PART_NO: SN74LVC1G97DBVR

## Nets that join several sheets
3.3V: S3_Connectors (7 pins), S4_Power_Supply (C4.1 R18.2 U5.4), S5_Communications (25 pins), S6_Solenoid_Valve_Interlock (15 pins)
5.0V: S3_Connectors (J16.2 J16.4 J21.1 J26.1), S4_Power_Supply (C3.1 R17.2 U4.4 U5.2)
12.0V: S3_Connectors (7 pins), S4_Power_Supply (C2.1 R15.2 U3.3)
GND: S3_Connectors (23 pins), S4_Power_Supply (18 pins), S5_Communications (30 pins), S6_Solenoid_Valve_Interlock (21 pins)
RELAY_GND: S3_Connectors (8 pins), S4_Power_Supply (LED3.K SW2.1)
VBATT: S3_Connectors (J1.2 J2.2), S4_Power_Supply (SW1.2 U2.1 U4.1)
VBATT_RELAY: S3_Connectors (8 pins), S4_Power_Supply (R16.2 SW1.1)
12V_RELAY: S3_Connectors (J17.1), S4_Power_Supply (J29.1 J30.1)
ESC1_PWM: S3_Connectors (J18.1), S5_Communications (U7.7)
ESC2_PWM: S3_Connectors (J19.1), S5_Communications (U7.8)
ESC3_PWM: S3_Connectors (J22.1), S5_Communications (U7.9)
ESC4_PWM: S3_Connectors (J23.1), S5_Communications (U7.10)
ESC5_PWM: S3_Connectors (J24.1), S5_Communications (U7.11)
ESC6_PWM: S3_Connectors (J25.1), S5_Communications (U7.12)
ESC7_PWM: S3_Connectors (J27.1), S5_Communications (U7.13)
ESC8_PWM: S3_Connectors (J28.1), S5_Communications (U7.15)
I2C1_SCL: S3_Connectors (J20.2 R4.2 R11.1 U1.5), S5_Communications (U6.8 U8.8 U9.8)
I2C1_SDA: S3_Connectors (J20.3 R3.1 R10.1 U1.4), S5_Communications (U6.7 U8.7 U9.7)
I2C2_SCL: S3_Connectors (R2.1 R9.1), S5_Communications (U7.26)
I2C2_SDA: S3_Connectors (R1.1 R8.1), S5_Communications (U7.27)
Pack1_Cell0: S3_Connectors (J3.5), S5_Communications (8 pins)
Pack1_Cell1: S3_Connectors (J3.4), S5_Communications (R52.2)
Pack1_Cell2: S3_Connectors (J3.3), S5_Communications (R34.2)
Pack1_Cell3: S3_Connectors (J3.2), S5_Communications (R27.2)
Pack1_Cell4: S3_Connectors (J3.1), S5_Communications (R19.2)
Pack2_Cell0: S3_Connectors (J4.5), S5_Communications (8 pins)
Pack2_Cell1: S3_Connectors (J4.4), S5_Communications (R53.2)
Pack2_Cell2: S3_Connectors (J4.3), S5_Communications (R35.2)
Pack2_Cell3: S3_Connectors (J4.2), S5_Communications (R28.2)
Pack2_Cell4: S3_Connectors (J4.1), S5_Communications (R20.2)
Pressure_Voltage: S3_Connectors (J21.2), S5_Communications (R56.2)
SERVO_PWM: S3_Connectors (J26.3), S5_Communications (U7.6)
Valve_1: S3_Connectors (D1.A J5.2), S6_Solenoid_Valve_Interlock (Q1.2)
Valve_1_GPO: S3_Connectors (R5.1), S6_Solenoid_Valve_Interlock (U11.1)
Valve_2: S3_Connectors (D2.A J6.2), S6_Solenoid_Valve_Interlock (Q2.2)
Valve_2_GPO: S3_Connectors (R6.1), S6_Solenoid_Valve_Interlock (U13.1)
Valve_3: S3_Connectors (D3.A J7.2), S6_Solenoid_Valve_Interlock (Q3.2)
Valve_3_GPO: S3_Connectors (R7.1), S6_Solenoid_Valve_Interlock (U15.1)